# Altium schematic sheet WireLessPhone_Power.SchDoc
size 420 x 297 mm; DocumentNumber: ФНКЦ.542321.001 Э3; SheetNumber: 2; Format: A3
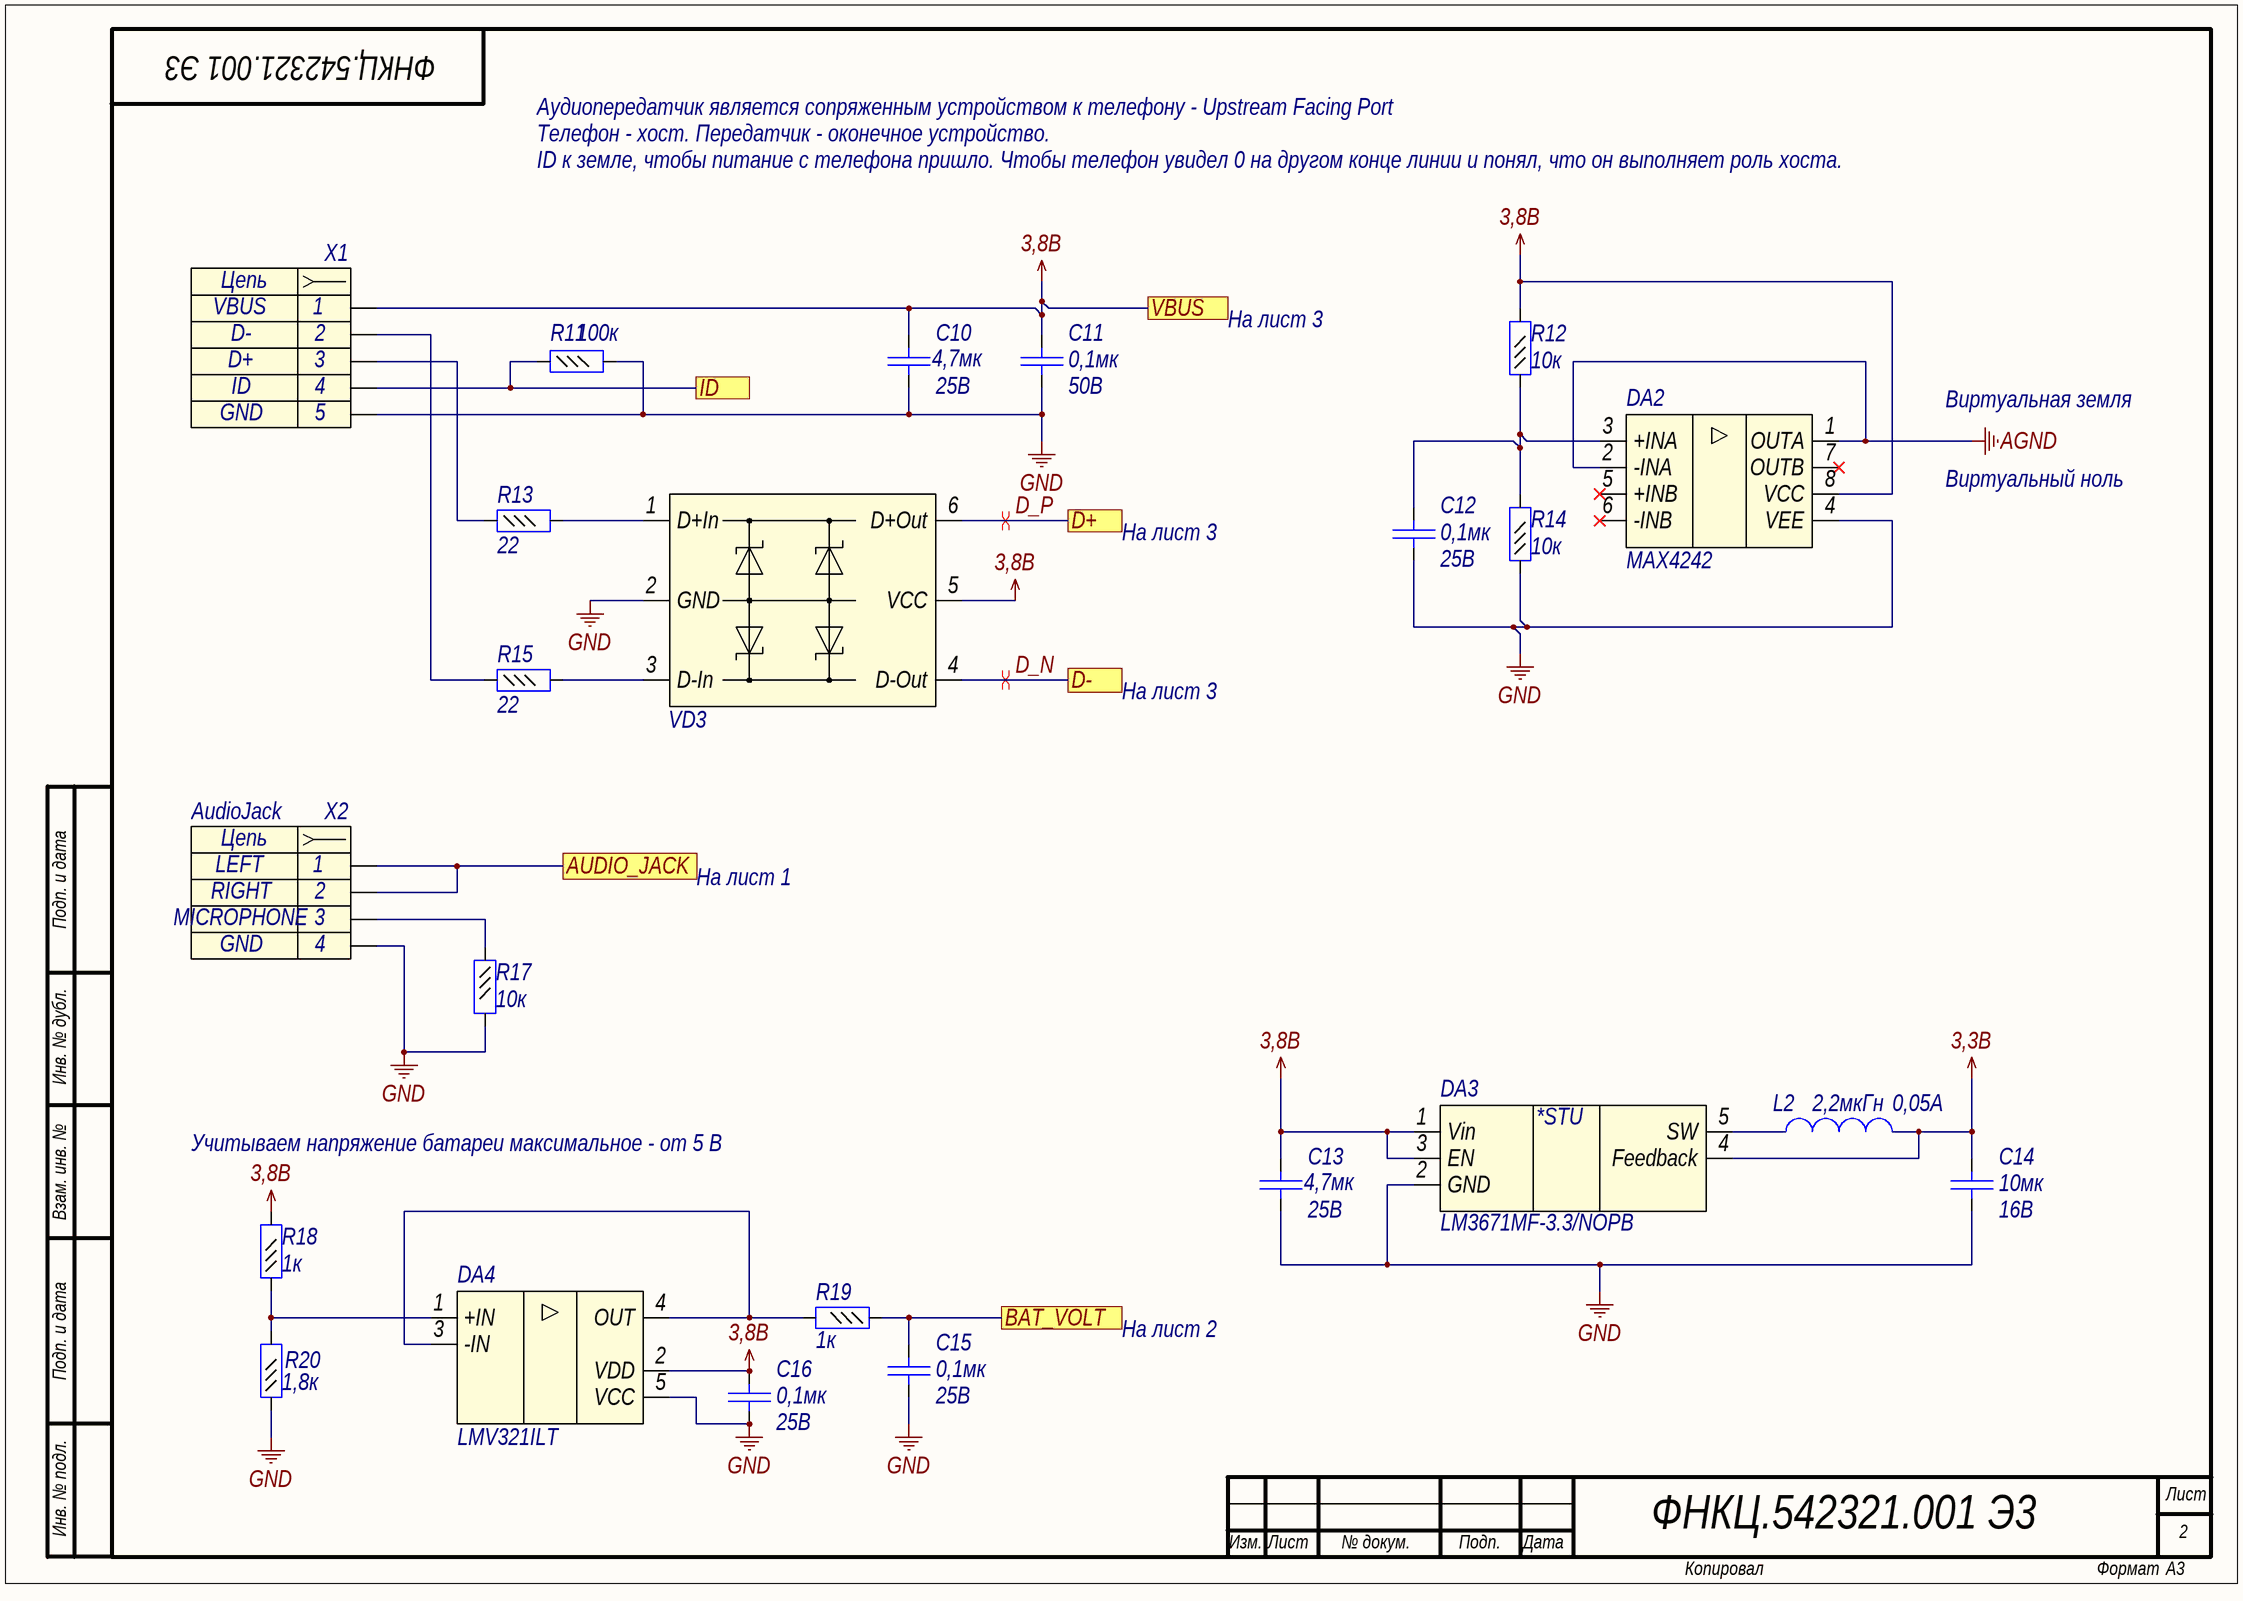
[diagram p0: WireLessPhone_Power.SchDoc]

## Parts
C10  value 4,7мк  Voltage: 25B  [C0805]  (hidden comment: Capacitor)
C11  value 0,1мк  Voltage: 50B  [C0603]  (hidden comment: Capacitor)
C12  value 0,1мк  Voltage: 25B  [C0402]  (hidden comment: Capacitor)
C13  value 4,7мк  Voltage: 25B  [C0805]  (hidden comment: Capacitor)
C14  value 10мк  Voltage: 16В  [C1206]  (hidden comment: Capacitor)
C15  value 0,1мк  Voltage: 25B  [C0402]  (hidden comment: Capacitor)
C16  value 0,1мк  Voltage: 25B  [C0402]  (hidden comment: Capacitor)
DA2  MAX4242  [8µMAX]
DA3  LM3671MF-3.3/NOPB  [SOT23-5]
DA4  LMV321ILT  [SOT23-5]
L2  value 2,2мкГн  Rated Current: 0,05A  [L0805]  (hidden comment: Inductor)
R11  value 100к  [R0402]  (hidden comment: Resistor_0,062Вт)
R12  value 10к  [R0402]  (hidden comment: Resistor_0,062Вт)
R13  value 22  [R0402]  (hidden comment: Resistor_0,062Вт)
R14  value 10к  [R0402]  (hidden comment: Resistor_0,062Вт)
R15  value 22  [R0402]  (hidden comment: Resistor_0,062Вт)
R17  value 10к  [R0402]  (hidden comment: Resistor_0,062Вт)
R18  value 1к  [R0402]  (hidden comment: Resistor_0,062Вт)
R19  value 1к  [R0402]  (hidden comment: Resistor_0,062Вт)
R20  value 1,8к  [R0402]  (hidden comment: Resistor_0,062Вт)
VD3  USBUF  [SOT323-6L]  (value not drawn)
X1  Header_5_sct  [5HOLE_SMALL]  (value not drawn)
X2  AudioJack  [4HOLE_SMALL]

## Ports
AUDIO_JACK, BAT_VOLT, D+, D-, ID, VBUS

## Nets
3,3B: C14.2 DA3.4(Feedback) L2.2
3,8B: C10.2 C11.2 C13.2 C16.1 DA2.8(VCC) DA3.1(Vin) DA3.3(EN) DA4.2(VDD) R12.2 R18.2 VD3.5(VCC) X1.1 ; port VBUS
AGND: DA2.1(OUTA) DA2.2(-INA)
GND: C10.1 C11.1 C12.2 C13.1 C14.1 C15.2 C16.2 DA2.4(VEE) DA3.2(GND) DA4.5(VCC) R11.2 R14.1 R17.2 R20.1 VD3.2(GND) X1.5 X2.4
AUDIO_JACK: X2.1 X2.2 ; port AUDIO_JACK
BAT_VOLT: C15.1 R19.1 ; port BAT_VOLT
D_N: VD3.4(D-Out) ; port D-
D_P: VD3.6(D+Out) ; port D+
ID: R11.1 X1.4 ; port ID
NetC12_1: C12.1 DA2.3(+INA) R12.1 R14.2
NetDA3_5: DA3.5(SW) L2.1
NetDA4_1: DA4.1(+IN) R18.1 R20.2
NetDA4_3: DA4.3(-IN) DA4.4(OUT) R19.2
NetR13_1: R13.1 X1.3
NetR13_2: R13.2 VD3.1(D+In)
NetR15_1: R15.1 X1.2
NetR15_2: R15.2 VD3.3(D-In)
NetR17_1: R17.1 X2.3

Not connected (* = marked no-connect by the designer): DA2 5(+INB)* 6(-INB)* 7(OUTB)*

## Layout directives
differential pair: D_N, D_P

## Notes on the sheet
- Аудиопередатчик является сопряженным устройством к телефону - Upstream Facing Port
- Телефон - хост. Передатчик - оконечное устройство.
- ID к земле, чтобы питание с телефона пришло. Чтобы телефон увидел 0 на другом конце линии и понял, что он выполняет роль хоста.
- На лист 3
- Виртуальная земля
- Виртуальный ноль
- Подп. и дата
- На лист 1
- Инв. № дубл.
- Взам. инв. №
- Учитываем напряжение батареи максимальное - от 5 В
- На лист 2
- Инв. № подл.
- Лист
- Изм.
- № докум.
- Подп.
- Дата
- Копировал
- Формат
- (in symbol connect44) Цепь
- (in symbol connect45) Цепь
- (in symbol pwr2) *STU

## Library data of the parts
C10 C13 = cap154: Конденсатор; Part Name: Ceramic; Manufacture: Murata; Part Number: GRM21BR61E475KA12L; id: cap154; TKE: X5R
C11 = cap131: Конденсатор; Part Name: Ceramic; Manufacture: Murata; Part Number: GRM188R71H104K; id: cap131; TKE: X7R
C12 C15 C16 = cap52: Конденсатор; Part Name: Ceramic; Manufacture: Murata; Part Number: GRM155F51E104Z**; id: cap52; TKE: Y5V
C14 = cap191: Конденсатор; Part Name: Ceramic; Manufacture: Murata; Part Number: GRM31CR71C106K*; id: cap191; TKE: X7R
DA2 = amp13: МИКРОМОЩНЫЙ Single/Dual/Quad, +1.8V/10µA, SOT23,  Beyond-the-Rails Op Amps; Part Name: Micropower / Operational Amplifiers; Part Number: MAX4242EUA; Manufacture: Maxim Integrated; id: amp13; Rail-to-rail: yes; Supply Voltage: 1,8В–5,5В or (+-)0,9В-(+-)2,75B; Supply Current max: 10uA; Bandwidth: 90kHz; Input Bias Current: (+-)2,3nA; CMRR: 90dB; PSRR: 85dB; Offset voltage: (+-)0,2mB; Channels: 1
DA3 = pwr2: Step-Down DC-DC Converter; Part Name: 600-mA Step-Down DC-DC Converter; Manufacturer: Texas Instruments; id: pwr2; Input Voltage: 2,7 - 5,5B; Output Voltage: 3,3B; Current: 0,6A; Type: Impulse; Part Number: LM3671MF-3.3/NOPB
DA4 = amp10: HIGH-DRIVE OPERATIONAL AMPLIFIERS WITH SHUTDOWN; Part Name: Micropower / Operational Amplifiers; Manufacture: ST Microelectronics; id: amp10; Rail-to-rail: yes; Supply Voltage: 2,7-6B; Supply Current max: 200uA; Bandwidth: 1MHz; Input Bias Current: 10nA; CMRR: 85dB; PSRR: 80dB; Offset voltage: 0,1mB; Channels: 1; Part Number: LMV321ILT
L2 = ind4: EMI Suppression Filter; Part Number: MLF2012A2R2KT000; Manufacture: Mouser; id: ind4; Resistance: 500mOhm; Part Name: Inductor
R11 = res314: Резистор; Manufacture: Yageo; Part Number: RC0402FR-07100KL; id: res314; Accuracy: 1%; Part Name: Resistor; Power: 0,062Вт
R12 R14 R17 = res290: Резистор; Manufacture: Yageo; Part Number: RC0402FR-0710KL; id: res290; Accuracy: 1%; Part Name: Resistor; Power: 0,062Вт
R13 R15 = res226: Резистор; Manufacture: Yageo; Part Number: RC0402FR-0722RL; id: res226; Accuracy: 1%; Part Name: Resistor; Power: 0,062Вт
R18 R19 = res266: Резистор; Manufacture: Yageo; Part Number: RC0402FR-071KL; id: res266; Accuracy: 1%; Part Name: Resistor; Power: 0,062Вт
R20 = res272: Резистор; Manufacture: Yageo; Part Number: RC0402FR-071K8; id: res272; Accuracy: 1%; Part Name: Resistor; Power: 0,062Вт
VD3 = diode14: EMEMI filter and line termination for USB upstream ports; Part Name: EMI filter for USB upstream ports; Part Number: USBUF02W6; Manufacture: ST Microelectronics; Capacitance: 47pF; Number of Channels: 2; id: diode14
X1 = connect44: Разъем - 5 конт. розетка; Part Name: SMALL HALL 5; Contact_1: VBUS; Contact_2: D-; Contact_3: D+; Contact_4: ID; Contact_5: GND; Etch: 1,5mm; id: connect44
X2 = connect45: Разъем - 4 конт. розетка; Part Name: SMALL HALL 4; Contact_1: LEFT; Contact_2: RIGHT; Contact_3: MICROPHONE; Contact_4: GND; Etch: 1,5mm; id: connect45